# Altium schematic sheet Board.SchDoc
size A
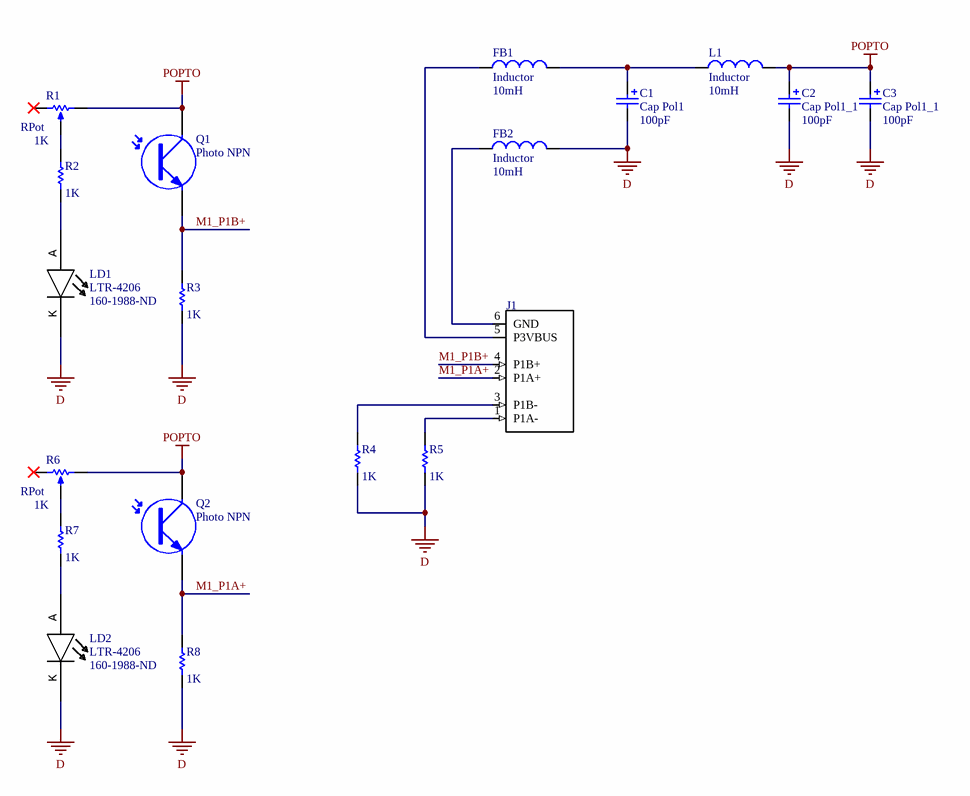
[diagram p0: Board.SchDoc]

## Parts
C1  Cap Pol1  value 100pF  [PCAP7343-43_Keme]
C2  Cap Pol1_1  value 100pF  [805 - CAP Poly]
C3  Cap Pol1_1  value 100pF  [805 - CAP Poly]
FB1  Inductor  value 10mH  [805]
FB2  Inductor  value 10mH  [805]
J1  640456-6  [TE_640456-6]  (value not drawn)
L1  Inductor  value 10mH  [805]
LD1  LTR-4206  Supplier Part Number 1: 160-1988-ND  [LED]
LD2  LTR-4206  Supplier Part Number 1: 160-1988-ND  [LED]
Q1  Photo NPN  [IR - TRANS]
Q2  Photo NPN  [IR - TRANS]
R1  RPot  value 1K  [ST-4EB]
R2  value 1K  [805]  (hidden comment: Res1)
R3  value 1K  [805]  (hidden comment: Res1)
R4  value 1K  [805]  (hidden comment: Res1)
R5  value 1K  [805]  (hidden comment: Res1)
R6  RPot  value 1K  [ST-4EB]
R7  value 1K  [805]  (hidden comment: Res1)
R8  value 1K  [805]  (hidden comment: Res1)

## Nets
D: C1.2 C2.2 C3.2 FB2.2 LD1.K LD2.K R3.1 R4.1 R5.1 R8.1
POPTO: C2.1 C3.1 L1.2 Q1.C Q2.C R1.2(BOT) R6.2(BOT)
M1_P1A+: J1.2(P1A+) Q2.E R8.2
M1_P1B+: J1.4(P1B+) Q1.E R3.2
NetC1_1: C1.1 FB1.2 L1.1
NetFB1_1: FB1.1 J1.5(P3VBUS)
NetFB2_1: FB2.1 J1.6(GND)
NetJ1_1: J1.1(P1A-) R5.2
NetJ1_3: J1.3(P1B-) R4.2
NetLD1_A: LD1.A R2.1
NetLD2_A: LD2.A R7.1
NetR1_3: R1.3(TAP) R2.2
NetR6_3: R6.3(TAP) R7.2

Not connected (* = marked no-connect by the designer): R1 1(TOP)*; R6 1(TOP)*

## Library data of the parts
C1 = Cap Pol1: Polarized Capacitor (Radial); Published: 8-Jun-2000; LatestRevisionDate: 17-Jul-2002; LatestRevisionNote: Re-released for DXP Platform.; PackageReference: RB7.6-15; Publisher: Altium Limited; PackageDescription: Polarized Capacitor (Radial); 2 Leads
C2 C3 = Cap Pol1_1: Polarized Capacitor 805; Published: 8-Jun-2000; LatestRevisionDate: 17-Jul-2002; LatestRevisionNote: Re-released for DXP Platform.; PackageReference: RB7.6-15; Publisher: Altium Limited; PackageDescription: Polarized Capacitor (Radial); 2 Leads
FB1 FB2 L1 = Inductor: Code_IEC: 1005; Published: 8-Jun-2000; LatestRevisionDate: 29-May-2009; LatestRevisionNote: IPC-7351 Footprint Added.; PackageReference: 0402-A; Publisher: Altium Limited; PackageDescription: Chip Inductor; Code_JEITA: 0402
J1 = 1x6_6pin_.1_VERTICAL_HEADER: 06P MTA100 HDR ASSY F/L SQ STR; Number_of_Positions: 6; Product_Type: Connector; Centerline_Pitch: 2.54 mm[.1 in]; MF: TE Connectivity; MP: 640456-6; Package: None; TE_purchase_URL: https://www.te.com/usa-en/product-640456-6.html?te_bu=Cor&te_type=disp&te_campaign=seda_glo_cor-seda-global-disp-prtnr-fy19-seda-model-bom-cta_sma-317_1&elqCampaignId=32493; Price: None; EU_RoHS_Compliance: Compliant; SnapEDA_Link: https://www.snapeda.com/parts/640456-6/TE%20Connectivity%20AMP%20Connectors/view-part/?ref=snap; Availability: Unavailable; Value: *
Q1 Q2 = Photo NPN: NPN Phototransistor; Published: 24-Mar-1999; LatestRevisionDate: 17-Jul-2002; LatestRevisionNote: Re-released for DXP Platform.; PackageReference: TO-220_A; Publisher: Altium Limited; Code_JEDEC: TO-220-AC
R1 R6 = RPot: Potentiometer; Sim Note: Enter the Resistance value and the set point into parameter fields.; Set Position: 0.5; Published: 8-Jun-2000; LatestRevisionDate: 17-Jul-2002; LatestRevisionNote: Re-released for DXP Platform.; PackageReference: VR5; Publisher: Altium Limited; PackageDescription: Variable Resistor, Thru-Hole; 3 Leads
R2-R5 R7 R8 = Res1: Resistor; Published: 8-Jun-2000; LatestRevisionDate: 17-Jul-2002; LatestRevisionNote: Re-released for DXP Platform.; PackageReference: AXIAL-0.3; Publisher: Altium Limited; PackageDescription: Axial Device, Thru-Hole; 2 Leads; 0.3 in Pin Spacing
LD1 LD2 = LTR-4206: Supplier 1: Digi-Key